# EAGLE design MainBoard (EAGLE 6.2)
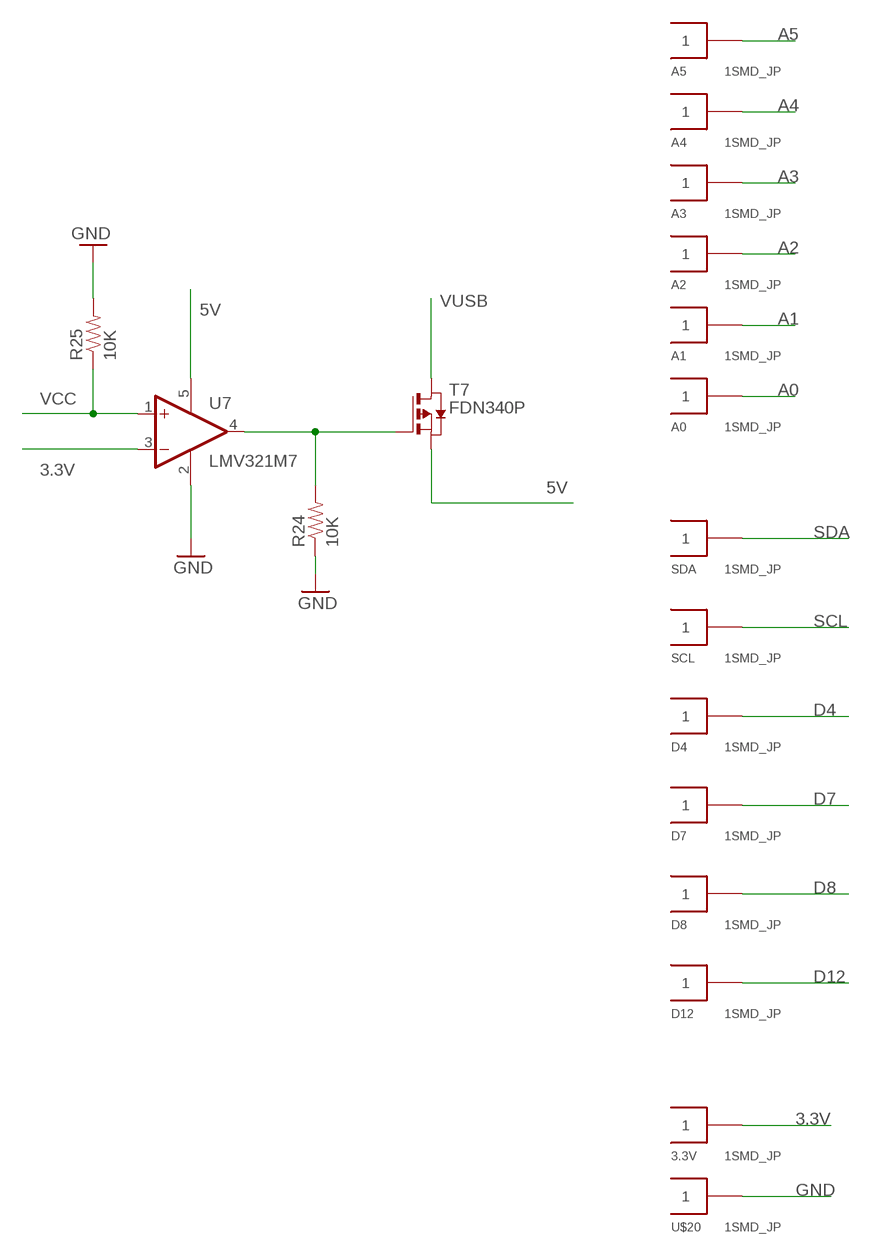
[diagram p0: schematic, sheet 1, part 1 of 2]
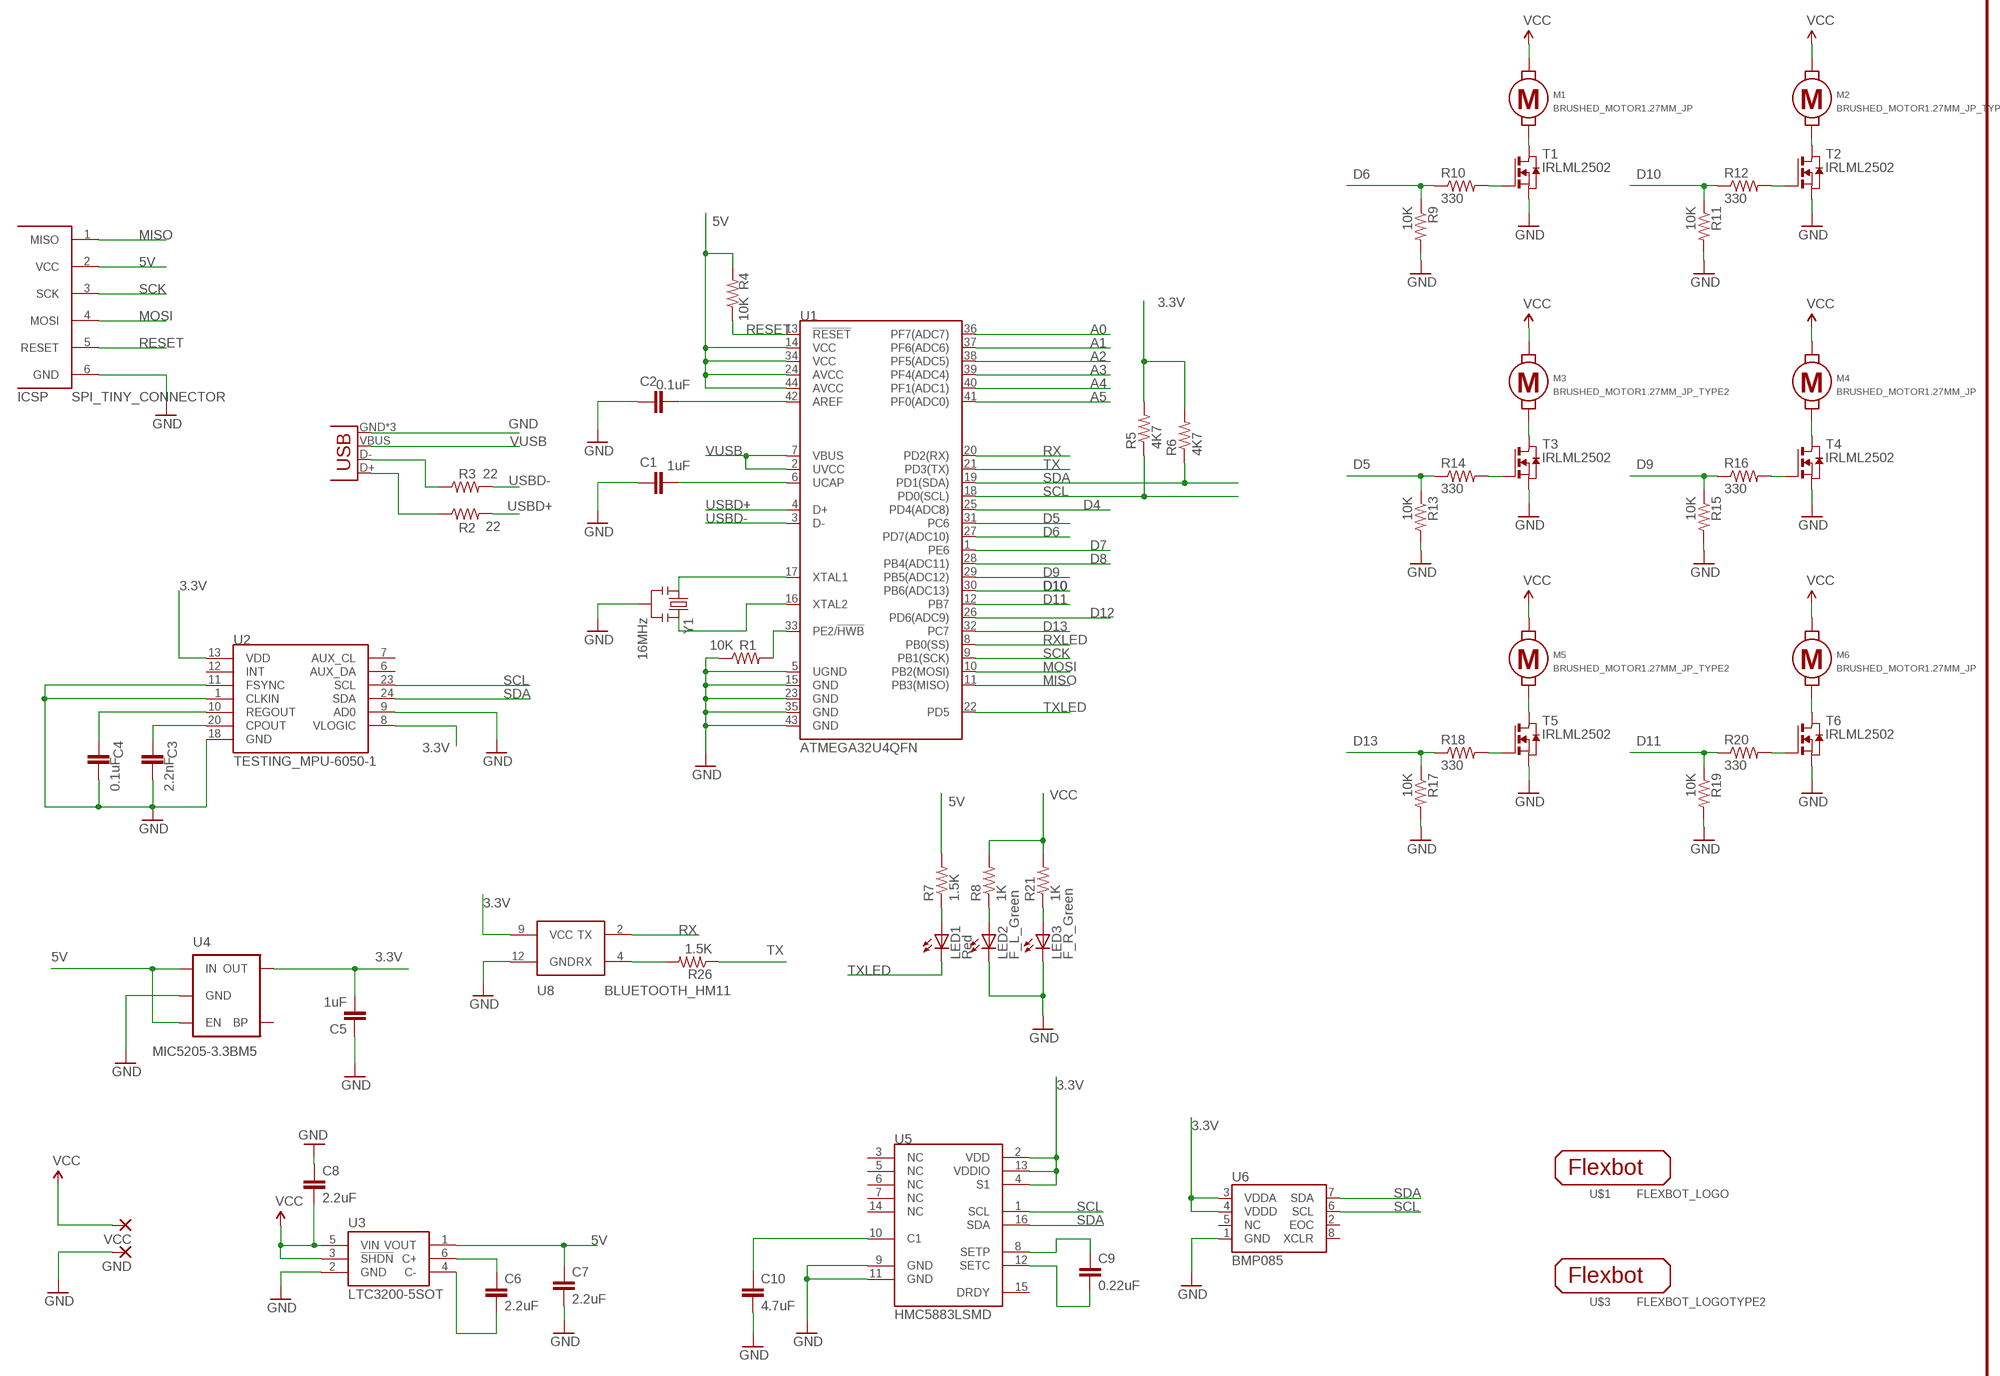
[diagram p1: schematic, sheet 1, part 2 of 2]

## Parts
3.3V  1SMD_JP  [1SMD]
A0  1SMD_JP  [1SMD]
A1  1SMD_JP  [1SMD]
A2  1SMD_JP  [1SMD]
A3  1SMD_JP  [1SMD]
A4  1SMD_JP  [1SMD]
A5  1SMD_JP  [1SMD]
C1  1uF  CAP0402-CAP  [0402-CAP]
C2  0.1uF  CAP0402-CAP  [0402-CAP]
C3  2.2nF  CAP0402-CAP  [0402-CAP]
C4  0.1uF  CAP0402-CAP  [0402-CAP]
C5  1uF  CAP0402-CAP  [0402-CAP]
C6  2.2uF  CAP0603-CAP  [0603-CAP]
C7  2.2uF  CAP0603-CAP  [0603-CAP]
C8  2.2uF  CAP0603-CAP  [0603-CAP]
C9  0.22uF  CAP0402-CAP  [0402-CAP]
C10  4.7uF  CAP0603-CAP  [0603-CAP]
D4  1SMD_JP  [1SMD]
D7  1SMD_JP  [1SMD]
D8  1SMD_JP  [1SMD]
D12  1SMD_JP  [1SMD]
GND  2,15/1,0  [2,15/1,0]
ICSP  SPI_TINY_CONNECTOR  AVR_ISP_TINY_CONNECTORAVR_ISP_TINY_CONNCTOR_NO_BORDER  [AVR_ISP_TINY_CONNECTOR_NO_BORDER]
JP1  USB-MICROB  [USB-MICROB]
LED1  Red  LEDCHIPLED_0603  [CHIPLED_0603]
LED2  F_L_Green  LEDCHIPLED_0603  [CHIPLED_0603]
LED3  F_R_Green  LEDCHIPLED_0603  [CHIPLED_0603]
M1  BRUSHED_MOTOR1.27MM_JP  [BRUSHED_MOTOR_1.27MM_JP]
M2  BRUSHED_MOTOR1.27MM_JP_TYPE2  [BRUSHED_MOTOR_1.27MM_JP_TYPE2]
M3  BRUSHED_MOTOR1.27MM_JP_TYPE2  [BRUSHED_MOTOR_1.27MM_JP_TYPE2]
M4  BRUSHED_MOTOR1.27MM_JP  [BRUSHED_MOTOR_1.27MM_JP]
M5  BRUSHED_MOTOR1.27MM_JP_TYPE2  [BRUSHED_MOTOR_1.27MM_JP_TYPE2]
M6  BRUSHED_MOTOR1.27MM_JP  [BRUSHED_MOTOR_1.27MM_JP]
R1  10K  RESISTOR0402-RES  [0402-RES]
R2  22  RESISTOR0402-RES  [0402-RES]
R3  22  RESISTOR0402-RES  [0402-RES]
R4  10K  RESISTOR0402-RES  [0402-RES]
R5  4K7  RESISTOR0402-RES  [0402-RES]
R6  4K7  RESISTOR0402-RES  [0402-RES]
R7  1.5K  RESISTOR0402-RES  [0402-RES]
R8  1K  RESISTOR0402-RES  [0402-RES]
R9  10K  RESISTOR0402-RES  [0402-RES]
R10  330  RESISTOR0402-RES  [0402-RES]
R11  10K  RESISTOR0402-RES  [0402-RES]
R12  330  RESISTOR0402-RES  [0402-RES]
R13  10K  RESISTOR0402-RES  [0402-RES]
R14  330  RESISTOR0402-RES  [0402-RES]
R15  10K  RESISTOR0402-RES  [0402-RES]
R16  330  RESISTOR0402-RES  [0402-RES]
R17  10K  RESISTOR0402-RES  [0402-RES]
R18  330  RESISTOR0402-RES  [0402-RES]
R19  10K  RESISTOR0402-RES  [0402-RES]
R20  330  RESISTOR0402-RES  [0402-RES]
R21  1K  RESISTOR0402-RES  [0402-RES]
R24  10K  RESISTOR0402-RES  [0402-RES]
R25  10K  RESISTOR0402-RES  [0402-RES]
R26  1.5K  RESISTOR0402-RES  [0402-RES]
SCL  1SMD_JP  [1SMD]
SDA  1SMD_JP  [1SMD]
T1  IRLML2502  NMOSSOT23  [SOT-23]
T2  IRLML2502  NMOSSOT23  [SOT-23]
T3  IRLML2502  NMOSSOT23  [SOT-23]
T4  IRLML2502  NMOSSOT23  [SOT-23]
T5  IRLML2502  NMOSSOT23  [SOT-23]
T6  IRLML2502  NMOSSOT23  [SOT-23]
T7  FDN340P  [SOT23]
U1  ATMEGA32U4QFN  [SPARKFUN-DIGITALIC_QFN-44]
U2  TESTING_MPU-6050-1  [TESTING_QFN-24-4MM2]
U3  LTC3200-5SOT  [SOT23-6]
U4  MIC5205-3.3BM5  MIC52053.3V  [SOT23-5]
U5  HMC5883LSMD  [16LPCC]
U6  BMP085  [BMP085]
U7  LMV321M7  [SC70-5L]
U8  BLUETOOTH_HM11  [BLUETOOTH_HM11]
U$1  FLEXBOT_LOGO  [FLEXBOT_LOGO]
U$3  FLEXBOT_LOGOTYPE2  [FLEXBOT_LOGO_TYPE2]
U$20  1SMD_JP  [1SMD]
VCC  2,15/1,0  [2,15/1,0]
Y1  16MHz  RESONATOR16MHZ  [RESONATOR-SMD]

## Nets
3.3V: 3.3V.1 C5.2 R5.2 R6.2 U2.8(VLOGIC) U2.13(VDD) U4.5(OUT) U5.2(VDD) U5.4(S1) U5.13(VDDIO) U6.3(VDDA) U6.4(VDDD) U7.3(-IN) U8.9(VCC)
5V: C7.1 ICSP.2(VCC) R4.2 R7.2 T7.2(S) U1.14(VCC) U1.24(AVCC) U1.34(VCC) U1.44(AVCC) U3.1(VOUT) U4.1(IN) U4.3(EN) U7.5(V+)
A0: A0.1 U1.36(PF7(ADC7))
A1: A1.1 U1.37(PF6(ADC6))
A2: A2.1 U1.38(PF5(ADC5))
A3: A3.1 U1.39(PF4(ADC4))
A4: A4.1 U1.40(PF1(ADC1))
A5: A5.1 U1.41(PF0(ADC0))
D4: D4.1 U1.25(PD4(ADC8))
D5: R13.1 R14.1 U1.31(PC6)
D6: R9.1 R10.1 U1.27(PD7(ADC10))
D7: D7.1 U1.1(PE6)
D8: D8.1 U1.28(PB4(ADC11))
D9: R15.1 R16.1 U1.29(PB5(ADC12))
D10: R11.1 R12.1 U1.30(PB6(ADC13))
D11: R19.1 R20.1 U1.12(PB7)
D12: D12.1 U1.26(PD6(ADC9))
D13: R17.1 R18.1 U1.32(PC7)
GND: C1.1 C2.1 C3.2 C4.2 C5.1 C7.2 C8.1 C10.2 GND.1(P) ICSP.6(GND) JP1.GND JP1.MT1(GND) JP1.MT2(GND) LED2.C LED3.C R1.1 R9.2 R11.2 R13.2 R15.2 R17.2 R19.2 R24.1 R25.2 T1.2(S) T2.2(S) T3.2(S) T4.2(S) T5.2(S) T6.2(S) U1.5(UGND) U1.15(GND) U1.23(GND) U1.35(GND) U1.43(GND) U2.1(CLKIN) U2.9(AD0) U2.11(FSYNC) U2.18(GND) U3.2(GND) U4.2(GND) U5.9(GND) U5.11(GND) U6.1(GND) U7.2(V-) U8.12(GND) U$20.1 Y1.2
MISO: ICSP.1(MISO) U1.11(PB3(MISO))
MOSI: ICSP.4(MOSI) U1.10(PB2(MOSI))
N$1: U1.17(XTAL1) Y1.1
N$2: U1.16(XTAL2) Y1.3
N$3: JP1.D+ R2.1
N$4: JP1.D- R3.1
N$5: C1.2 U1.6(UCAP)
N$6: C2.2 U1.42(AREF)
N$7: LED2.A R8.1
N$8: C4.1 U2.10(REGOUT)
N$9: C3.1 U2.20(CPOUT)
N$10: LED1.A R7.1
N$11: R1.2 U1.33(PE2/!HWB)
N$12: R18.2 T5.3(G)
N$13: LED3.A R21.1
N$14: R12.2 T2.3(G)
N$15: R10.2 T1.3(G)
N$16: M1.P$1 T1.1(D)
N$17: M2.P$1 T2.1(D)
N$18: R14.2 T3.3(G)
N$19: M3.P$1 T3.1(D)
N$20: R16.2 T4.3(G)
N$21: M4.P$1 T4.1(D)
N$22: M5.P$1 T5.1(D)
N$23: C9.1 U5.8(SETP)
N$25: C6.1 U3.6(C+)
N$27: C6.2 U3.4(C-)
N$28: C9.2 U5.12(SETC)
N$29: C10.1 U5.10(C1)
N$31: R20.2 T6.3(G)
N$32: M6.P$1 T6.1(D)
N$34: R24.2 T7.3(G) U7.4(OUT)
N$35: R26.2 U8.4(RX)
RESET: ICSP.5(RESET) R4.1 U1.13(!RESET)
RX: U1.20(PD2(RX)) U8.2(TX)
RXLED: U1.8(PB0(SS))
SCK: ICSP.3(SCK) U1.9(PB1(SCK))
SCL: R5.1 SCL.1 U1.18(PD0(SCL)) U2.23(SCL) U5.1(SCL) U6.6(SCL)
SDA: R6.1 SDA.1 U1.19(PD1(SDA)) U2.24(SDA) U5.16(SDA) U6.7(SDA)
TX: R26.1 U1.21(PD3(TX))
TXLED: LED1.C U1.22(PD5)
USBD+: R2.2 U1.4(D+)
USBD-: R3.2 U1.3(D-)
VCC: C8.2 M1.P$2 M2.P$2 M3.P$2 M4.P$2 M5.P$2 M6.P$2 R8.2 R21.2 R25.1 U3.3(!SHDN) U3.5(VIN) U7.1(+IN) VCC.1(P)
VUSB: JP1.VBUS T7.1(D) U1.2(UVCC) U1.7(VBUS)
Unconnected: U2.6(AUX_DA) U2.7(AUX_CL) U2.12(INT) U4.4(BP) U5.3(NC) U5.5(NC) U5.6(NC) U5.7(NC) U5.14(NC) U5.15(DRDY) U6.2(EOC) U6.5(NC) U6.8(XCLR)

## Library data of the parts
3.3V A0 A1-A5 D4 D7 D8 D12 SCL SDA U$20 = HexAirbot-HexNano:1SMD_JP
C1-C10 = SparkFun-Passives:CAP: Capacitor Standard 0603 ceramic capacitor, and 0.1" leaded capacitor.
GND VCC = wirepad:2,15/1,0: THROUGH-HOLE PAD
ICSP = ilib-avr-isp-connector:AVR_ISP_TINY_CONNECTOR
JP1 = SparkFun-Connectors:USB: USB Connectors USB-B-PTH is fully proven SKU : PRT-00139/CONN-08278 USB-miniB is fully proven SKU : PRT-00587 USB-A-PCB is untested. USB-A-H is throughly reviewed, but untested. Spark Fun Electronics SKU : PRT-00437 USB-B-SMT is throughly reviewed, but untested. Needs silkscreen touching up. USB-A-S has not been used/tested USB-MB-H has not been used/tested USB-MICROB has been used. CONN-09505; PROD_ID: CONN-09505
LED1-LED3 = led:LED: LED OSRAM: - CHIPLED LG R971, LG N971, LY N971, LG Q971, LY Q971, LO R971, LY R971 LH N974, LH R974 LS Q976, LO Q976, LY Q976 LO Q996 - Hyper CHIPLED LW Q18S LB Q993, LB Q99A, LB R99A - SideLED LS A670, LO A670, LY A670, LG A670, LP A670 LB A673, LV A673, LT A673, LW A673 LH A674 LY A675 LS A676, LA A676, LO A676, LY A676, LW A676 LS A679, LY A679, LG A679 - Hyper Micro SIDELED® LS Y876, LA Y876, LO Y876, LY Y876 LT Y87S - SmartLED LW L88C, LW L88S LB L89C, LB L89S, LG L890 LS L89K, LO L89K, LY L89K LS L896, LA L896, LO L896, LY L896 - TOPLED LS T670, LO T670, LY T670, LG T670, LP T670 LSG T670, LSP T670, LSY T670, LOP T670, LYG T670 LG T671, LOG T671, LSG T671 LB T673, LV T673, LT T673, LW T673 LH T674 LS T676, LA T676, LO T676, LY T676, LB T676, LH T676, LSB T676, LW T676 LB T67C, LV T67C, LT T67C, LS T67K, LO T67K, LY T67K, LW E67C LS E67B, LA E67B, LO E67B, LY E67B, LB E67C, LV E67C, LT E67C LW T67C LS T679, LY T679, LG T679 LS T770, LO T770, LY T770, LG T770, LP T770 LB T773, LV T773, LT T773, LW T773 LH T774 LS E675, LA E675, LY E675, LS T675 LS T776, LA T776, LO T776, LY T776, LB T776 LHGB T686 LT T68C, LB T68C - Hyper Mini TOPLED® LB M676 - Mini TOPLED Santana® LG M470 LS M47K, LO M47K, LY M47K Source: http://www.osram.convergy.de LUXEON: - LUMILED® LXK2-PW12-R00, LXK2-PW12-S00, LXK2-PW14-U00, LXK2-PW14-V00 LXK2-PM12-R00, LXK2-PM12-S00, LXK2-PM14-U00 LXK2-PE12-Q00, LXK2-PE12-R00, LXK2-PE12-S00, LXK2-PE14-T00, LXK2-PE14-U00 LXK2-PB12-K00, LXK2-PB12-L00, LXK2-PB12-M00, LXK2-PB14-N00, LXK2-PB14-P00, LXK2-PB14-Q00 LXK2-PR12-L00, LXK2-PR12-M00, LXK2-PR14-Q00, LXK2-PR14-R00 LXK2-PD12-Q00, LXK2-PD12-R00, LXK2-PD12-S00 LXK2-PH12-R00, LXK2-PH12-S00 LXK2-PL12-P00, LXK2-PL12-Q00, LXK2-PL12-R00 Source: www.luxeon.com KINGBRIGHT: KA-3528ASYC Source: www.kingbright.com
M1-M6 = HexAirbot-HexNano:BRUSHED_MOTOR
R1-R21 R24-R26 = SparkFun-Passives:RESISTOR: Resistor Basic schematic elements and footprints for 0603, 1206, and PTH resistors.
T1-T6 = zetex:NMOSSOT23: MOS FET; OC_FARNELL: unknown; OC_NEWARK: unknown
T7 = HexAirbot-HexNano:FDN340P: MOS FET
U1 = SparkFun-DigitalIC:ATMEGA32U4: Atmel 44-pin 8-bit Microcontroller with 32KBytes of ISP Flash and USB Controller ----- Please use the QFN-44-NOPAD_1:1 package for the footprint of all boards using a 32U4. Route traces directly away from the pads as much as possible.
U2 = MPU6050:TESTING_MPU-6050
U3 = HexAirbot-HexNano:LTC3200-5: Linear Technology. Low Noise, Regulated Charge Pump DC/DC Converters, SOT23-6. Fixed 5V ± 4% Output or ADJ VIN Range: 2.7V to 4.5V
U4 = SparkFun-PowerIC:MIC5205: MIC5205 150mA vreg 3.3V - VREG-00822 5V - VREG-00823; PROD_ID: VREG-00822
U5 = HexAirbot-HexNano:HMC5883L: 3 Axis Digital Compass IC
U6 = HexAirbot-HexNano:BMP085: BMP085 Pressure Sensor Great little MEMS pressure sensor. SKU: COM-09603
U7 = linear:LMV321?*: General Purpose, Low Voltage, Rail-to-Rail Output Operational Amplifiers Source: http://www.national.com/mpf/LM/LMV321.html http://www.national.com/dt/lmv_qual.pdf
U8 = HexAirbot-HexNano:BLUETOOTH_HM11: BLE 4.0 Module
U$1 U$3 = HexAirbot-HexNano:FLEXBOT_LOGO
Y1 = SparkFun-FreqCtrl:RESONATOR: Resonator Small SMD resonator. Used, eg, on the Arduino Pro/ Pro Mini boards. 8MHz- XTAL-08895 16MHz- XTAL-08900; PROD_ID: XTAL-08900

## Board
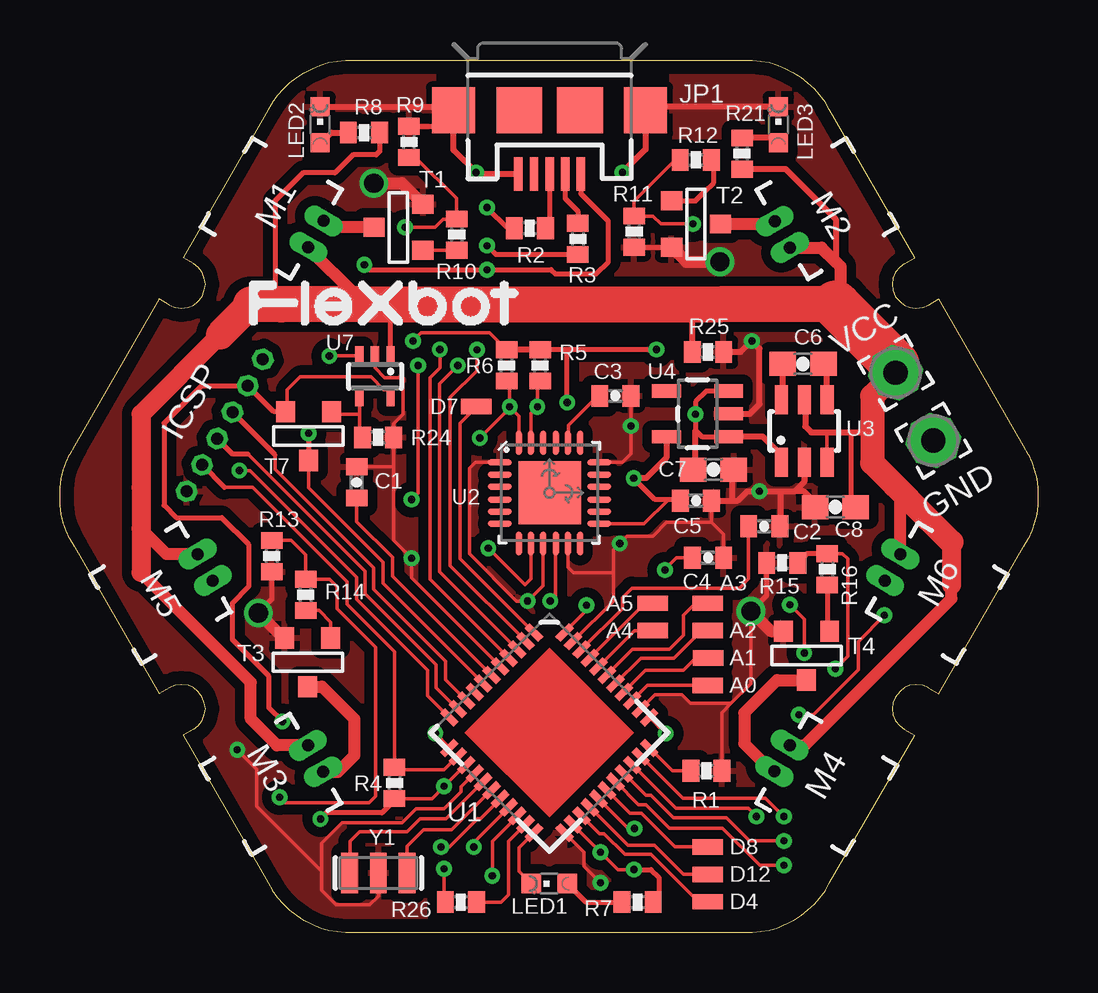
[diagram p2: board, top side]
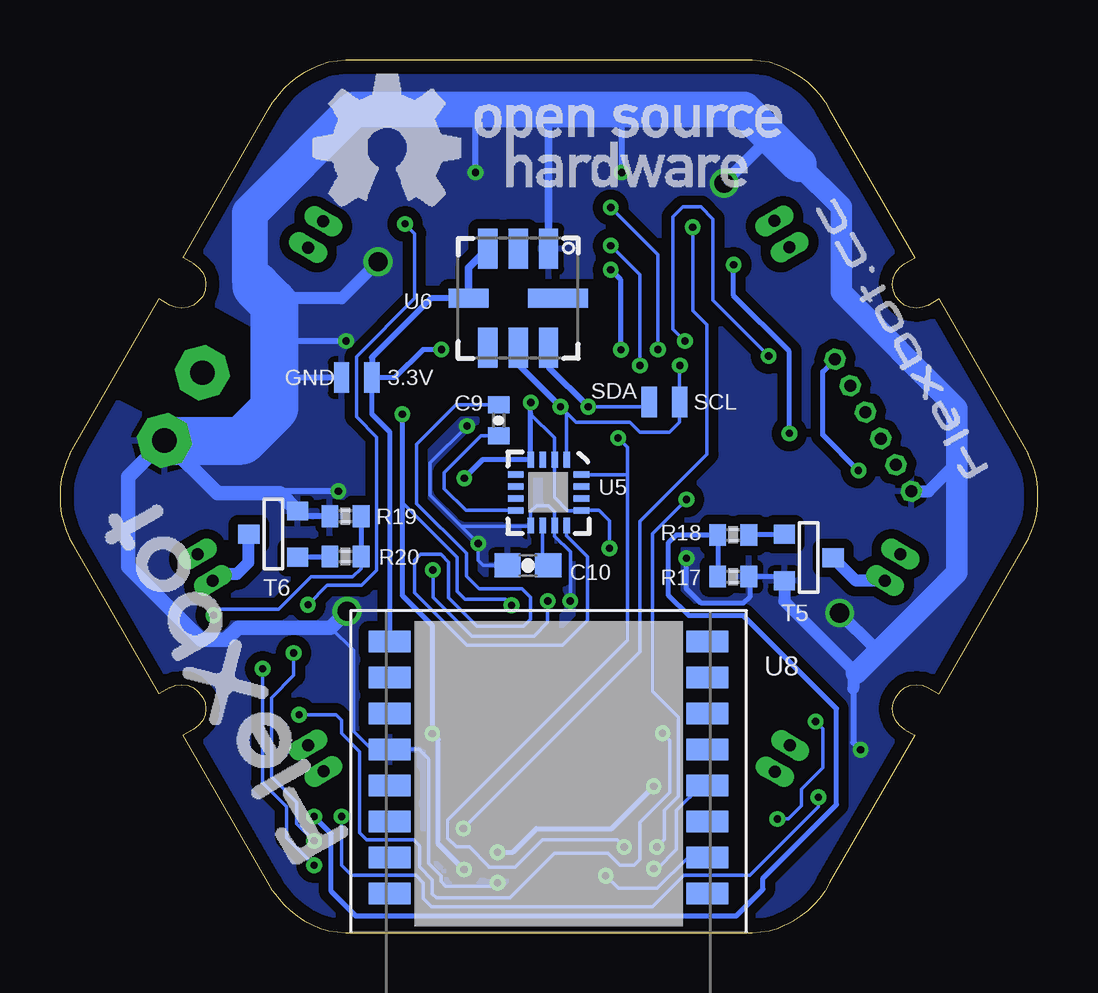
[diagram p3: board, bottom side, seen from below]

Size 40.77 x 36.37 mm. Coordinates in mm from the lower left corner, seen from the top.
Outline: 32.08,34.29 31.9,34.62 31.45,35.18 31.17,35.43 30.89,35.66 30.58,35.84 30.25,36.02 29.92,36.14 29.57,36.27 28.85,36.37 11.91,36.37 11.2,36.27 10.85,36.14 10.52,36.02 10.19,35.84 9.88,35.66 9.58,35.43 9.32,35.18 9.07,34.9 8.86,34.62 8.69,34.29 5.13,28.14 5.56,27.89 5.77,27.74 5.92,27.53 6.02,27.28 6.07,27.03 6.02,26.77 5.92,26.52 5.77,26.31 5.56,26.16 5.33,26.06 5.05,26.04 4.8,26.06 4.57,26.16 4.14,26.42 0.58,20.27 0.41,19.94 0.25,19.61 0.13,19.28 0.05,18.92 0,18.54 0,17.83 0.05,17.45 0.13,17.09 0.25,16.76 0.41,16.43 0.58,16.1 4.14,9.96 4.57,10.21 4.8,10.31 5.05,10.34 5.33,10.31 5.56,10.21 5.77,10.06 5.92,9.83 6.02,9.6 6.07,9.35 6.02,9.09 5.92,8.84 5.77,8.64 5.56,8.48 5.13,8.23 8.69,2.08 8.86,1.75 9.07,1.47 9.32,1.19 9.58,0.94 9.88,0.71 10.19,0.51 10.85,0.2 11.2,0.1 11.91,0 28.85,0 29.57,0.1 29.92,0.2 30.58,0.51 30.89,0.71 31.17,0.94 31.45,1.19 31.9,1.75 32.08,2.08 35.64,8.23 35.2,8.48 35,8.64 34.82,8.84 34.72,9.09 34.7,9.35 34.72,9.6 34.82,9.83 35,10.06 35.2,10.21 35.43,10.31 35.69,10.34 35.97,10.31 36.2,10.21 36.63,9.96 40.18,16.1 40.36,16.43 40.51,16.76 40.61,17.09 40.72,17.45 40.77,17.83 40.77,18.54 40.72,18.92 40.61,19.28 40.51,19.61 40.36,19.94 40.18,20.27 36.63,26.42 36.2,26.16 35.97,26.06 35.69,26.04 35.43,26.06 35.2,26.16 35,26.31 34.82,26.52 34.72,26.77 34.7,27.03 34.72,27.28 34.82,27.53 35,27.74 35.2,27.89 35.64,28.14 32.08,34.29
Copper layers (1*16): Top 0.035mm / dielectric 1.5mm / Bottom 0.035mm
Design rules: minimum track width 6mil, minimum drill 0.3mm, track to track 8mil, track to pad 8mil, pad to pad 8mil, via to via 10mil, smd to smd 8mil, copper to edge 22mil, drill to drill 8mil, minimum pad ring 7mil, minimum via ring 7mil, stop-mask expansion 4mil, vias tented up to drill 50mil, thermal gap 10mil

### Footprints (pad centres in the part's own frame; a part is rotated, then mirrored left to right if it is on the bottom)
1SMD = smd 1.27 x 0.635: 1 0,0
0402-CAP = smd 0.7 x 0.9: 1 -0.65,0; 2 0.65,0
0603-CAP = smd 1.1 x 1: 1 -0.85,0; 2 0.85,0
2,15/1,0 = drill 1.016 pad 2.159 octagon: 1 0,0
AVR_ISP_TINY_CONNECTOR_NO_BORDER = drill 0.5 octagon: 1 0,0; 2 0,-1.27; 3 0,-2.54; 4 0,-3.81; 5 0,-5.08; 6 0,-6.35
USB-MICROB = smd 0.35 x 1.4: D+ 0,2.65; D- -0.65,2.65; GND 1.3,2.65; ID 0.65,2.65; VBUS -1.3,2.65 | smd 1.8 x 1.9: MT1 -4,0; MT2 4,0 | smd 1.9 x 1.9: P$1 -1.27,0; P$2 1.27,0
CHIPLED_0603 = smd 0.8 x 0.8: A 0,-0.75; C 0,0.75
BRUSHED_MOTOR_1.27MM_JP = drill 0.5 long: P$1 -0.635,0; P$2 0.635,0
BRUSHED_MOTOR_1.27MM_JP_TYPE2 = drill 0.5 long: P$1 -0.635,0; P$2 0.635,0
0402-RES = smd 0.7 x 0.9: 1 -0.65,0; 2 0.65,0
SOT-23 = smd 0.787 x 0.889: 1 0.025,-1.016; 2 -0.94,1.016; 3 0.991,1.016
SOT23 = smd 0.787 x 0.889: 1 0.025,-1.016; 2 -0.94,1.016; 3 0.991,1.016
SPARKFUN-DIGITALIC_QFN-44 = smd 0.8 x 0.3: 1 -3.4,2.5; 2 -3.4,2; 3 -3.4,1.5; 4 -3.4,1; 5 -3.4,0.5; 6 -3.4,0; 7 -3.4,-0.5; 8 -3.4,-1; 9 -3.4,-1.5; 10 -3.4,-2; 11 -3.4,-2.5; 23 3.4,-2.5; 24 3.4,-2; 25 3.4,-1.5; 26 3.4,-1; 27 3.4,-0.5; 28 3.4,0; 29 3.4,0.5; 30 3.4,1; 31 3.4,1.5; 32 3.4,2; 33 3.4,2.5 | smd 0.3 x 0.8: 12 -2.5,-3.4; 13 -2,-3.4; 14 -1.5,-3.4; 15 -1,-3.4; 16 -0.5,-3.4; 17 0,-3.4; 18 0.5,-3.4; 19 1,-3.4; 20 1.5,-3.4; 21 2,-3.4; 22 2.5,-3.4; 34 2.5,3.4; 35 2,3.4; 36 1.5,3.4; 37 1,3.4; 38 0.5,3.4; 39 0,3.4; 40 -0.5,3.4; 41 -1,3.4; 42 -1.5,3.4; 43 -2,3.4; 44 -2.5,3.4
TESTING_QFN-24-4MM2 = smd 1.016 x 0.254: 1 -2.066,1.257; 2 -2.066,0.75; 3 -2.066,0.247; 4 -2.066,-0.287; 5 -2.066,-0.792; 6 -2.066,-1.297; 13 2.086,-1.297; 14 2.086,-0.792; 15 2.086,-0.287; 16 2.086,0.247; 17 2.086,0.75; 18 2.086,1.257 | smd 0.254 x 1.016: 7 -1.267,-2.122; 8 -0.762,-2.122; 9 -0.258,-2.122; 10 0.278,-2.122; 11 0.78,-2.122; 12 1.287,-2.122; 19 1.287,2.082; 20 0.78,2.082; 21 0.278,2.082; 22 -0.258,2.082; 23 -0.762,2.082; 24 -1.267,2.082 | smd 2.616 x 2.616: P$1 0.02,-0.01
SOT23-6 = smd 0.55 x 1.2: 1 -0.95,-1.3; 2 0,-1.3; 3 0.95,-1.3; 4 0.95,1.3; 5 0,1.3; 6 -0.95,1.3
SOT23-5 = smd 0.55 x 1.2: 1 -0.95,-1.3; 2 0,-1.3; 3 0.95,-1.3; 4 0.95,1.3; 5 -0.95,1.3
16LPCC = smd 0.65 x 0.28: 1 -1.37,0.75; 2 -1.37,0.25; 3 -1.37,-0.25; 4 -1.37,-0.75; 9 1.37,-0.75; 10 1.37,-0.25; 11 1.37,0.25; 12 1.37,0.75 | smd 0.28 x 0.65: 5 -0.75,-1.37; 6 -0.25,-1.37; 7 0.25,-1.37; 8 0.75,-1.37; 13 0.75,1.37; 14 0.25,1.37; 15 -0.25,1.37; 16 -0.75,1.37
BMP085 = smd 1.67 x 0.8: 1 -2.065,1.27; 2 -2.065,0; 3 -2.065,-1.27; 5 2.065,-1.27; 6 2.065,0; 7 2.065,1.27 | smd 0.8 x 1.67: 4 0,-2.065 | smd 0.8 x 2.5: 8 0,1.65
SC70-5L = smd 0.35 x 0.8: 1 -0.65,-0.85; 2 0,-0.85; 3 0.65,-0.85; 4 0.65,0.85; 5 -0.65,0.85
BLUETOOTH_HM11 = smd 1.75 x 0.9: 1 -6.625,4.859; 2 -6.625,3.359; 3 -6.625,1.859; 4 -6.625,0.359; 5 -6.625,-1.141; 6 -6.625,-2.641; 7 -6.625,-4.141; 8 -6.625,-5.641; 9 6.625,-5.641; 10 6.625,-4.141; 11 6.625,-2.641; 12 6.625,-1.141; 13 6.625,0.359; 14 6.625,1.859; 15 6.625,3.359; 16 6.625,4.859
RESONATOR-SMD = smd 0.7 x 1.7: 1 -1.2,0; 2 0,0; 3 1.2,0

### Placement (x,y rotation side)
3.3V  27.76,23.14 270 bottom
A0  27,10.31 0 top
A1  27.01,11.46 0 top
A2  27,12.6 0 top
A3  27,13.74 0 top
A4  24.71,12.6 0 top
A5  24.71,13.74 0 top
C1  12.37,18.77 270 top
C2  29.36,16.95 180 top
C3  23.15,22.38 0 top
C4  27.01,15.63 0 top
C5  26.51,18.01 180 top
C6  30.98,23.71 0 top
C7  27.24,19.3 0 top
C8  32.32,17.74 0 top
C9  22.48,21.36 90 bottom
C10  21.26,15.32 180 bottom
D4  27,1.3 0 top
D7  17.36,21.93 0 top
D8  27,3.58 0 top
D12  27,2.44 0 top
GND  36.41,20.52 120 top
ICSP  8.46,23.9 330 top
JP1  20.41,34.28 180 top
LED1  20.4,2.06 90 top
LED2  10.85,33.68 0 top
LED3  29.95,33.68 0 top
M1  10.67,29.12 240 top
M2  30.11,29.11 300 top
M3  10.65,7.27 120 top
M4  30.1,7.28 60 top
M5  6.05,15.24 120 top
M6  34.71,15.24 60 top
R1  26.95,6.76 180 top
R2  19.58,29.36 180 top
R3  21.59,28.92 270 top
R4  13.94,6.25 270 top
R5  20.02,23.65 90 top
R6  18.62,23.65 90 top
R7  24.08,1.28 0 top
R8  12.67,33.35 0 top
R9  14.54,32.96 90 top
R10  16.54,29.1 270 top
R11  23.94,29.22 270 top
R12  26.51,32.21 0 top
R13  8.83,15.71 270 top
R14  10.24,14.09 270 top
R15  30.11,15.42 180 top
R16  31.99,15.15 270 top
R17  12.7,14.85 0 bottom
R18  12.7,16.59 0 bottom
R19  28.87,17.36 180 bottom
R20  28.87,15.68 180 bottom
R21  28.44,32.47 270 top
R24  13.26,20.65 180 top
R25  27.01,24.21 0 top
R26  16.71,1.28 180 top
SCL  14.94,22.12 270 bottom
SDA  16.21,22.12 270 bottom
T1  14.11,29.43 270 top
T2  26.51,29.52 90 top
T3  10.3,11.28 0 top
T4  31.09,11.56 0 top
T5  9.56,15.61 90 bottom
T6  31.88,16.64 270 bottom
T7  10.34,20.7 0 top
U1  20.4,8.35 315 top
U2  20.4,18.35 0 top
U3  31.03,20.92 0 top
U4  26.58,21.63 90 top
U5  20.4,18.35 270 bottom
U6  21.67,26.44 270 bottom
U7  13.13,23.19 180 top
U8  20.4,6.5 180 bottom
U$1  8.13,27 0 top
U$3  27.2,32.74 0 bottom
U$20  29.03,23.14 270 bottom
VCC  34.84,23.34 120 top
Y1  13.27,2.5 180 top

### Tracks (layer width: path | path; a pad name or v marks a point on that pad's centre or on a via)
3.3V  (via drill 0.3)
  Top 0.152: U2.13 24.35,17.05 25.36,18.06 | v17.86,16.03 19.38,14.5 19.63,14.76 U2.8 | R5.2 20.5,24.3 | 24.57,24.3 24.58,24.31 | R6.2 17.91,25.01 15.06,25.01 v14.72,24.66 | U7.3 v11.23,24.04
  Top 0.203: 24.57,24.3 21.16,24.3 | 21.16,24.3 R5.2 | 24.58,24.31 v24.87,24.31 | v21.15,22.1 21.15,24.28 21.16,24.3 | 25.81,18.06 25.36,18.06 24.8,18.06 v23.91,18.95
  Top 0.254: R5.2 R6.2 | 25.81,18.06 C5.2 | U4.5 25.28,19.79 24.44,18.95 v23.91,18.95
  Bottom 0.152: U5.2 20.16,18.15 19.6,17.6 U5.13 18.29,17.6 17.86,17.17 v17.86,16.03 | U5.2 | U8.9 27,12.16 | 23.95,26.44 U6.4 | v11.23,24.04 13.54,26.35 13.54,29.74 14.05,30.25 14.81,30.25 15.21,29.85 15.21,25.16 v14.72,24.66 | U5.2 20.16,20.62 21.15,21.62
  Bottom 0.203: v23.91,18.95 23.15,19.72 U5.4 21.15,21.62 v21.15,22.1 | U8.9 27.02,20.87 27.76,21.62 3.3V.1 26.81,23.14 25.64,24.31 v24.87,24.31
  Bottom 0.254: U6.4 25.3,26.44 27.76,23.98 3.3V.1
  Bottom 0.305: U6.3 23.73,27.71 U6.4
5V  (via drill 0.3)
  Top 0.152: 21.4,4.53 U1.24 21.39,4.51 v22.53,3.37 23.25,2.64 v23.93,2.64 | U1.44 21.95,13.44 v21.95,13.65 | U7.5 13.78,22.64 13.49,22.64 12.97,23.16 10.01,23.16 9.47,22.63 9.47,21.79 T7.2 | 16.9,7 U1.14 16.91,7 v16.02,6.11 15.5,5.6 R4.2 | U1.34 v25.25,8.31
  Top 0.203: U4.3 26.95,22.58 26.49,22.12 v26.49,21.62 26.49,20.94 26.76,20.68 U4.1 | v9.27,8.81 8.71,9.37 8.71,10.69 7.19,12.22 7.19,13.74 7.86,14.41 7.86,16.19 6.74,17.31 4.85,17.31 4.34,17.82 4.34,21.25 5.91,22.81 7.82,22.81 ICSP.2 8.91,21.72 T7.2 | v23.93,2.64 24.64,2.64 24.97,2.31 24.97,1.52 R7.2 | R4.2 13.94,5.52 13.42,5 11.11,5 v10.86,4.75
  Top 0.254: U3.1 30.08,19.9 29.3,20.68 U4.1 | C7.1 26.49,19.4 26.49,20.94
  Bottom 0.152: 26.49,17.93 24.21,15.65 24.21,14.24 23.88,13.91 22.2,13.91 v21.95,13.65 | v9.27,8.81 8.97,8.51 8.97,6.88 9.86,5.99 9.86,5.3 10.4,4.75 v10.86,4.75
  Bottom 0.203: v26.49,21.62 26.49,17.93 26.49,14.06 25.25,12.81 v25.25,8.31 25.01,8.06 25.01,3.72 v23.93,2.64 | v22.53,3.37 21.88,3.37 20.9,4.34 17.78,4.34 v16.02,6.11
A0
  Top 0.152: U1.36 24.48,10.31 A0.1
A1
  Top 0.152: U1.37 24.41,10.95 25.98,10.95 26.49,11.46 A1.1
A2
  Top 0.152: U1.38 24.21,11.46 25.59,11.46 26.73,12.6 A2.1 26.57,12.6
A3
  Top 0.152: U1.39 23.86,11.81 25.4,11.81 25.98,12.4 25.98,13.23 26.49,13.74 A3.1
A4
  Top 0.152: U1.40 22.46,11.11 23.95,12.6 A4.1
A5
  Top 0.152: U1.41 24.38,13.74 A5.1
D4
  Top 0.152: U1.25 22.48,4.14 22.68,4.14 23.55,3.28 24.63,3.28 26.61,1.3 D4.1
D5  (via drill 0.3)
  Top 0.152: R14.1 | U1.31 23.87,7 25.68,5.19 28.69,5.19 v29.03,4.85 | R14.1 11.24,14.74 11.56,14.43 11.56,13.51 13.16,11.91 13.16,5.7 12.88,5.42 9.39,5.42 v9.16,5.65 | R14.1 10.24,15.75 9.63,16.37 8.84,16.37 R13.1
  Bottom 0.152: v29.03,4.85 29.03,2.82 28.61,2.4 25.93,2.4 25.63,2.1 25.63,1.45 25.27,1.09 16.07,1.09 14.76,2.4 12.01,2.4 9.16,5.26 v9.16,5.65
D6  (via drill 0.3)
  Top 0.152: R9.1 14.83,32.31 16.54,30.6 R10.1 15.98,29.74 15.63,29.4 v14.39,29.4 | U1.27 23.68,4.36 v23.95,4.36
  Bottom 0.152: v23.95,4.36 16.59,11.72 16.59,17.16 13.79,19.95 13.79,25.34 14.38,25.92 v14.38,29.4 v14.39,29.4
D7
  Top 0.152: U1.1 19.74,12.52 16.68,15.58 16.68,21.25 D7.1
D8
  Top 0.152: D8.1 25.64,3.58 24.23,4.99 23.76,4.99 22.81,5.94 U1.28
D9  (via drill 0.3)
  Top 0.152: v30.18,2.82 29.17,2.82 27.62,4.37 25.41,4.37 24.44,5.35 24.12,5.35 23.17,6.3 U1.29 | v32.32,11.01 32.84,11.53 32.84,15.59 32.63,15.8 R16.1
  Top 0.203: R16.1 31.14,15.8 R15.1
  Bottom 0.152: v30.18,2.82 31.32,3.96 31.32,5.26 32.32,6.26 v32.32,11.01
D10  (via drill 0.3)
  Top 0.152: 25.91,32.21 R12.1 25.65,32.21 23.94,30.49 R11.1 24.71,29.87 25.04,29.54 v26.38,29.54 v26.39,29.54 | v30.18,3.84 28.74,3.84 27.78,4.8 25.57,4.8 24.64,5.73 24.44,5.73 U1.30 | v30.43,13.68 31.03,13.08 v31.03,11.67
  Bottom 0.152: v30.43,13.68 29.63,14.48 28.19,14.48 27.56,15.11 27.56,20.66 28.41,21.51 28.41,24.02 25.98,26.44 25.98,29.14 v26.39,29.54 | v30.18,3.84 30.9,4.56 30.9,5.45 31.95,6.5 31.95,9.8 31.03,10.73 v31.03,11.67
D11  (via drill 0.3)
  Top 0.152: U1.12 16.22,7.69 | U1.12 | v15.65,8.32 16.22,7.74 U1.12 | v34.37,13.23 33.27,12.14 33.27,10.96 31.41,9.09 v30.8,9.09
  Bottom 0.152: v15.65,8.32 15.34,8.01 15.34,5.85 16.59,4.61 16.59,3.07 16.84,2.82 17.42,2.82 17.93,3.33 20.14,3.33 22.01,1.46 25.07,1.46 25.25,1.64 25.25,2.22 25.78,2.76 25.78,3.63 26.04,3.89 27.99,3.89 28.27,4.17 28.27,7.56 29.03,8.32 29.03,8.86 29.26,9.09 v30.8,9.09 | R20.1 28.22,15.18 28.56,14.83 30.3,14.83 31.65,13.49 34.11,13.49 v34.37,13.23
  Bottom 0.203: R19.1 R20.1
D12
  Top 0.152: D12.1 25.98,2.44 24.78,3.64 23.68,3.64 U1.26
D13  (via drill 0.3)
  Top 0.152: U1.32 25.96,5.61 29.41,5.61 v30.18,4.85
  Bottom 0.203: R17.1 R18.1 15.08,16.59 15.39,16.27 15.39,14.06 14.55,13.22 12.27,13.22 8.39,9.35 8.39,5.35 11.46,2.29 11.46,1.83 12.57,0.71 28.45,0.71 29.46,1.73 29.46,4.14 v30.18,4.85
GND  (via drill 0.3, 0.8)
  Top 0.152: 24.45,34.32 JP1.MT1 24.96,34.82 | U2.18 | U1.23 21.84,3.37 21.84,2.78 v22.53,2.1 | U2.9 20.14,14.47 v19.49,13.83 19.04,13.83 17.07,15.8 17.07,19.35 17.32,19.6 U2.1 | U1.35 24.81,9.93 25.92,9.93 26.29,9.56 27.98,9.56 | U2.11 21.18,15.25 21.41,15.01 23.08,15.01 | U1.5 18.33,11.11 | C1.1 13.91,19.42 | U2.18 22.49,19.6 | 23.08,15.01 23.08,15.98 v23.33,16.23 23.64,16.54 24.71,16.54 25.29,17.11 27.17,17.11 | U1.43 21.41,12.17 23.08,13.83 23.08,15.01 | C4.2 27.66,16.61 27.17,17.11 | 27.17,17.11 C5.1 | U1.5 | 13.91,19.42 R24.1 13.91,21.22 14.3,21.62 14.3,23.14 13.54,23.14 13.13,23.55 U7.2 | U1.15 16.71,6.08 16.71,5.88 16.02,5.18 14.85,5.18 14.26,4.6 11.76,4.6 10.91,3.75 10.91,2.57 | R1.1 27.6,9.18 27.98,9.56 | 10.91,2.57 8.2,5.27 8.2,6.82 v7.39,7.63 | 27.98,9.56 28.8,10.39 v28.8,13.4 | U2.18 23.44,19.6 23.8,19.96 v23.8,21.12 C3.2 | 13.91,19.42 13.91,16.36 v14.66,15.61 14.66,14.8 U1.5 | Y1.2 13.27,1.54 12.9,1.17 11.52,1.17 10.91,1.78 10.91,2.57
  Top 0.203: JP1.GND | R9.2 16.41,33.6 | R15.2 29.46,14.05 v28.8,13.4 | R13.2 8.83,13.9 v8.27,13.34 | R11.2 T2.2
  Top 0.254: JP1.MT2 16.41,33.6 16.41,32.6 16.43,32.6 v17.35,31.69 17.41,31.63 JP1.GND | 16.84,34.43 16.84,34.32 | 16.84,34.32 16.41,34.32 JP1.MT2 | U4.2 28.75,21.63 29.16,22.03 29.16,24.35 v28.84,24.66 28.38,24.21 R25.2 | U3.2 31.03,18.8 30.63,18.4 | C5.1 28.02,18.01 | 28.02,18.01 28.26,18.01 28.65,18.4 v29.16,18.4 30.05,18.4 | v23.44,31.69 24.41,32.65 JP1.MT1 24.56,34.43 LED3.C | 16.26,34.43 JP1.MT2 | 30.05,18.4 30.63,18.4 | 30.63,18.4 31.01,18.4 31.47,17.94 C8.1 | C2.1 30.05,16.99 30.05,18.4 | LED2.C 17.09,34.43 17.09,34.32 16.84,34.32 | C7.2 28.02,19.23 28.02,18.01
  Top 0.5: v27.51,27.97 26.11,27.97 T2.2 | v13.08,31.24 14.25,31.24 T1.2 | v28.8,13.4 29.63,12.57 T4.2 | T3.2 9.31,12.29 v8.27,13.34
  Bottom 0.152: R17.2 12.01,14.81 | v19.49,13.83 19.49,15.89 20.15,16.54 U5.11 20.15,17.56 20.4,17.81 20.9,17.81 21.15,17.56 U5.9 21.18,16.95 24.05,16.95 | v23.8,21.12 25.34,19.58 25.34,18.24 24.05,16.95 | 22.1,15.33 C10.2 | 24.05,16.95 v23.33,16.23 23.33,15.53 23.13,15.33 22.1,15.33 | 7.7,10.69 7.57,10.82 | 29.48,12.73 28.52,11.77 28.52,8.41 27.76,7.64 U8.12 25.79,7.65 25.41,7.26 25.41,2.91 24.88,2.38 24.88,2.15 24.69,1.96 22.67,1.96 v22.53,2.1 | 21.92,15.51 22.1,15.33
  Bottom 0.203: T5.2 10.74,14.85 R17.2 | 12.01,14.81 12.01,14 12.27,13.74 14.05,13.74 14.66,14.35 v14.66,15.61
  Bottom 0.254: v23.44,31.69 23.44,34.32 | 17.09,34.32 17.35,34.06 v17.35,31.69 | 31.62,21.87 31.83,21.87 | 31.06,21.62 31.32,21.62 31.83,22.12 | U$20.1 31.83,23.14 | v28.84,24.66 31.83,24.66 | 7.7,10.19 7.7,7.94 v7.39,7.63 | v29.16,18.4 31.74,18.4 31.83,18.31 | R19.2 30.64,17.36 T6.2
  Bottom 0.305: U6.1 20.4,34.32
  Bottom 0.4: 11.63,33.17 11.51,33.17 11.38,33.17 | 11.25,33.17 11.13,33.17
  Bottom 0.5: v27.51,27.97 29.03,26.44 32.08,26.44 | T5.2 10.57,13.82 7.57,10.82 | 11.38,33.17 11.25,33.17 | ICSP.6 4.56,18.4 3.38,19.58 | v8.27,13.34 6.81,11.87 6.81,11.58 | v13.08,31.24 11.51,32.82 11.51,33.17
  Bottom 0.508: 7.7,10.69 7.7,10.19
  Bottom 0.6: T6.2 31.6,18.31 31.83,18.31 34.2,18.31 GND.1 37.92,19 37.92,15.27 34.87,12.22 33.86,12.22 33.35,12.73 29.48,12.73 v28.8,13.4
  Bottom 0.9: 9.98,32.03 8.2,30.25 8.2,26.7 3.38,21.87 3.38,19.58 3.38,15.01 6.81,11.58 7.57,10.82
  Bottom 1.5: 32.59,26.95 32.84,27.2 32.84,30 28.52,34.32 23.44,34.32 20.4,34.32 17.09,34.32 12.27,34.32 11.13,33.17 9.98,32.03
  Bottom 2: GND.1 33.18,20.52 31.83,21.87 31.83,22.12 31.83,23.14 31.83,24.66 31.83,26.19 32.08,26.44 32.59,26.95
  pour Bottom (isolate 0.406): 0.08,0.03 40.72,0.03 40.72,19.33 39.01,22.44 34.91,20.33 34.04,19.77 31.36,24.56 36.16,27.22 35.81,27.84 30.86,36.36 11.51,36.35 0.08,36.35
  pour Top (isolate 0.406): 15.57,36.35 15.57,29.74 25.51,29.74 25.51,36.35 30.81,36.35 38.05,24.04 33.86,21.62 36.14,17.3 40.59,19.66 41.35,18.24 31,-0.06 25.84,-0.11 9.98,0.03 4.7,8.81 0.97,15.43 -0.43,18.31 5.54,28.83 5.44,28.63 8.17,33.31 8.32,33.62 9.98,36.35
MISO  (via drill 0.3)
  Top 0.152: U1.11 16.21,8.98 | 16.21,9 15.32,9.89 15.32,10.95 12.37,13.89 12.37,14.82 7.93,19.27 v7.48,19.27
  Top 0.203: 16.21,8.98 16.21,9
  Bottom 0.203: ICSP.1 8.97,23.39 8.97,20.75 v7.48,19.27
MOSI
  Top 0.152: U1.10 16.57,9.35 16.56,9.35 15.68,10.22 15.68,11.18 12.73,14.14 12.73,15.06 7.84,19.95
  Top 0.203: ICSP.4 7.2,19.95 7.84,19.95
N$1
  Top 0.152: U1.17 17.95,5.94 17.95,5.92 16.33,4.31 15.16,4.31 14.47,3.61 Y1.1
N$2
  Top 0.152: 12.08,2.51 Y1.3 12.09,2.52 12.09,3.82 12.48,4.22 14.47,4.22 15.01,4.76 16.1,4.76 U1.16 | U1.16
N$3
  Top 0.152: JP1.D+ 20.4,31.61 | 20.4,29.36 R2.1
  Top 0.203: 20.4,31.61 20.4,29.36
N$4
  Top 0.152: JP1.D-
  Top 0.203: JP1.D- 21.06,30.61 21.59,30.07 R3.1
N$5
  Top 0.152: U1.6 17.99,10.76 17.97,10.76 13.86,14.87 13.86,15.65 12.37,17.13 C1.2
N$6
  Top 0.152: U1.42 23.44,13.51 23.44,13.97 23.84,14.36 28.32,14.36 28.71,14.75 C2.2
N$7
  Top 0.203: 10.87,32.91 LED2.A
  Top 0.254: 10.87,32.91 11.32,33.35 R8.1
N$8  (via drill 0.3)
  Top 0.152: U2.10 20.66,16.22 20.66,14.06 v20.43,13.83 | v25.22,15.13 25.22,15.16 25.69,15.63 C4.1
  Bottom 0.152: v25.22,15.13 25.22,14 23.6,12.37 21.01,12.37 20.43,12.94 v20.43,13.83
N$9
  Top 0.152: U2.20 21.2,20.45 21.2,21.15 22.43,22.38 C3.1
N$10
  Top 0.203: LED1.A 21.92,1.28 21.93,1.28 R7.1
N$11
  Top 0.152: U1.33 25.52,6.76 R1.2
N$12
  Bottom 0.203: R18.2 12.03,16.6 T5.3
N$13
  Top 0.152: LED3.A 29.86,32.93
  Top 0.254: 29.86,32.93 29.67,33.12 R21.1
N$14
  Top 0.203: R12.2 27.25,32.11 27.25,31.27 26.87,30.89 26.49,30.51 T2.3
N$15
  Top 0.152: T1.3 R10.2
N$16
  Top 0.5: T1.1 11.25,29.4 M1.P$1
N$17
  Top 0.5: 29.68,29.54 M2.P$1 29.68,29.54 | T2.1 29.68,29.54
N$18
  Top 0.152: R14.2 10.79,13.44 11.29,12.94 T3.3
N$19
  Top 0.5: M3.P$1 11.59,6.72 12.27,7.39 12.27,8.92 10.92,10.26 T3.1
N$20
  Top 0.203: R16.2 31.99,12.67 T4.3
N$21
  Top 0.5: M4.P$1 29.68,6.73 28.52,7.89 28.52,9.17 29.89,10.54 T4.1
N$22
  Bottom 0.5: M5.P$1 7.59,14.69 T5.1
N$23
  Bottom 0.152: U5.8 23.84,17.6 24.75,18.52 24.75,19.18 23.22,20.71 C9.1
N$25
  Top 0.203: U3.6
  Top 0.254: U3.6 30.13,22.22 C6.1
N$27
  Top 0.203: U3.4
  Top 0.254: U3.4 31.98,23.56 C6.2
N$28
  Bottom 0.152: U5.12 19.65,16.55 18.78,15.68 18.78,13.03 19.82,11.99 23.8,11.99 25.98,14.17 25.98,15.52 25.73,15.77 24.89,15.77 24.56,15.44 24.56,13.96 23.39,12.78 23.38,12.79 21.45,12.79 21.16,13.08 21.16,14 21.51,14.35 23.3,14.35 23.83,14.87 23.83,15.81 25.9,17.88 25.9,20.37 24.25,22.01 C9.2
N$29
  Bottom 0.152: U5.10 20.65,15.32 C10.1
N$31
  Bottom 0.203: T6.3 29.81,15.65 29.77,15.68 R20.2
N$32
  Bottom 0.5: T6.1 32.92,16.61 32.92,15.43 33.4,14.95 34.13,14.95 M6.P$1
N$34
  Top 0.152: U7.4 12.48,21.62 | 12.48,21.62 12.48,20.78 R24.2 | T7.3 11.33,21.62 12.48,21.62
N$35  (via drill 0.3)
  Top 0.152: v16.02,2.68 16.02,1.33 R26.2
  Bottom 0.152: v16.02,2.68 15.86,2.68 15.06,3.48 15.06,5.11 14.02,6.14 U8.4
RESET
  Top 0.152: U1.13 16.58,7.33 | 6.85,18.57 8.04,18.57 11.96,14.64 11.96,13.7 13.94,11.72 R4.1 14.05,6.79 16.02,6.79 U1.13 | U1.13 16.55,7.36
  Top 0.203: ICSP.5 6.85,18.57
RX  (via drill 0.3)
  Top 0.152: U1.20 19.05,4.78 18.96,4.78 18.96,4.77 | 18.96,4.77 18.94,4.77 | 18.96,4.77 18.02,3.82 v18.02,2.39
  Bottom 0.152: U8.2 14.59,3.14 15.88,1.85 17.49,1.85 v18.02,2.39
SCK
  Top 0.152: U1.9 16.08,10.54 16.08,11.33 13.08,14.33 13.08,15.21 8.97,19.33 8.97,19.92
  Top 0.203: 8.97,19.92 ICSP.3
SCL  (via drill 0.3)
  Top 0.152: U2.23 | U1.18 18.34,5.55 18.32,5.55 17.53,4.76 17.41,4.76 16.23,3.58 v15.89,3.58 | U2.23 19.63,21.65 v19.9,21.92 19.9,22.88 R5.1 | v14.92,23.65 14.92,18.33 v14.66,18.06
  Bottom 0.152: U5.1 19.65,21.67 v19.9,21.92 19.25,21.27 17.01,21.27 16.59,20.85 15.35,20.85 14.94,21.27 SCL.1 14.94,23.63 v14.92,23.65 | v15.89,3.58 15.57,3.9 15.57,5.11 14.99,5.69 14.99,8.98 16.08,10.07 16.08,16.64 v14.66,18.06
  Bottom 0.254: v19.9,21.92 21.67,23.69 U6.6
SDA  (via drill 0.3)
  Top 0.152: U2.24 19.13,21.54 v18.75,21.92 | 18.7,5.22 U1.19 18.7,5.21 17.25,3.76 v17.25,3.58 | R6.1 arc-90 18.75,22.87 v18.75,21.92 | v17.5,20.62 18.75,21.87 v18.75,21.92
  Bottom 0.152: v17.25,3.58 17.55,3.89 20.65,3.89 21.81,2.73 22.87,2.73 22.87,2.76 23.7,3.58 24.24,3.58 24.61,3.95 24.61,4.7 17.11,12.2 17.11,19.1 | 17.11,19.1 17.11,20.23 v17.5,20.62 | v18.75,21.92 16.41,21.92 SDA.1 | U5.16 17.11,19.1
  Bottom 0.254: v18.75,21.92 20.4,23.57 U6.7
TX
  Top 0.152: 19.41,4.47 U1.21 18.69,3.82 18.69,1.6 18.38,1.28 R26.1
TXLED
  Top 0.152: U1.22 19.13,3.54 19.13,2.58 LED1.C
USBD+  (via drill 0.3)
  Top 0.152: U1.4 15.42,14.74 15.42,23.13 15.84,23.55 v15.84,24.31 | 18.81,29.36 R2.2
  Top 0.203: v17.81,30.23 18.67,29.36 R2.2
  Bottom 0.152: v15.84,24.31 15.84,28.26 v17.81,30.23
USBD-  (via drill 0.3)
  Top 0.152: U1.3 15.82,15.04 15.82,22.89 v16.59,23.65 | R3.2
  Top 0.203: v17.81,28.64 18.17,28.27 R3.2
  Bottom 0.152: v16.59,23.65 16.59,27.42 v17.81,28.64
VCC
  Top 0.152: 32.55,20.82 32.59,20.85 | U3.3 31.98,20.85
  Top 0.203: 9.22,26.19 8.97,26.44 8.97,30.51 10.13,31.67 11.47,31.67 12.22,32.42 13.18,32.42 13.32,32.57 R8.2 | 12.52,26.19 12.37,26.34 12.37,26.54 | U7.1 13.78,26.18 13.79,26.19 | 32.97,20.85 32.97,17.94 C8.2
  Top 0.254: 31.06,22.18 31.06,21.11 31.32,20.85 31.98,20.85 32.59,20.85 32.97,20.85 33.1,20.85 33.86,20.85 | 32.33,27.97 32.33,29.74 30.25,31.82 R21.2 | R25.1 26.36,26.06 26.24,26.19
  Top 0.5: 32.33,26.19 32.33,25.93 | 3.38,18.44 3.38,18.57 | 3.38,15.01 7.95,10.44 7.95,8.92 9.05,7.82 M3.P$2 | 28.07,26.19 27.51,26.19 | U3.5 31.06,22.18 | 36.02,17.04 36.02,17.42 | 12.52,26.19 12.52,26.39 12.37,26.54 10.35,28.56 M1.P$2 | 37.16,14.5 37.16,13.93 31.06,7.83 M4.P$2 | M6.P$2 35.03,18.41 34.8,18.65 | M2.P$2 31.74,28.56 32.33,27.97 32.54,27.76 32.54,25.99 | M5.P$2 4.44,15.79 3.38,16.85
  Top 0.8: 7.44,25.68 6.68,24.92 3.38,21.62 3.38,18.57 3.38,16.85 3.38,15.01 | 37.16,16.28 37.16,14.5
  Top 1: VCC.1 33.86,22.36 33.86,20.85 33.86,19.58 34.8,18.65 36.02,17.42 37.16,16.28
  Top 1.2: 7.95,26.19 6.68,24.92
  Top 1.5: 32.33,26.19 27.51,26.19 26.24,26.19 13.79,26.19 12.52,26.19 9.22,26.19 7.95,26.19
  Top 2: VCC.1 34.84,23.68 32.54,25.99 32.33,26.19
VUSB  (via drill 0.3)
  Top 0.152: 19.43,12.17 U1.2 16.27,15.3 16.27,22.31 17.39,23.43 v17.39,24.3 | T7.1 10.36,18.55 13.48,15.44 13.48,14.56 U1.7
  Top 0.203: v10.36,20.82 T7.1 | JP1.VBUS 21.71,30.81 22.86,29.65 22.86,27.97 22.35,27.46 20.65,27.46 20.47,27.64 v17.81,27.64 12.89,27.64 v12.69,27.84
  Bottom 0.203: v17.39,24.3 17.39,27.22 v17.81,27.64 | v10.36,20.82 10.36,24.23 12.69,26.56 v12.69,27.84

### Text on the board
bNames: GND